# Altium schematic sheet LPDDR4.SchDoc
size 420 x 297 mm; SheetNumber: 5; SheetTotal: 16
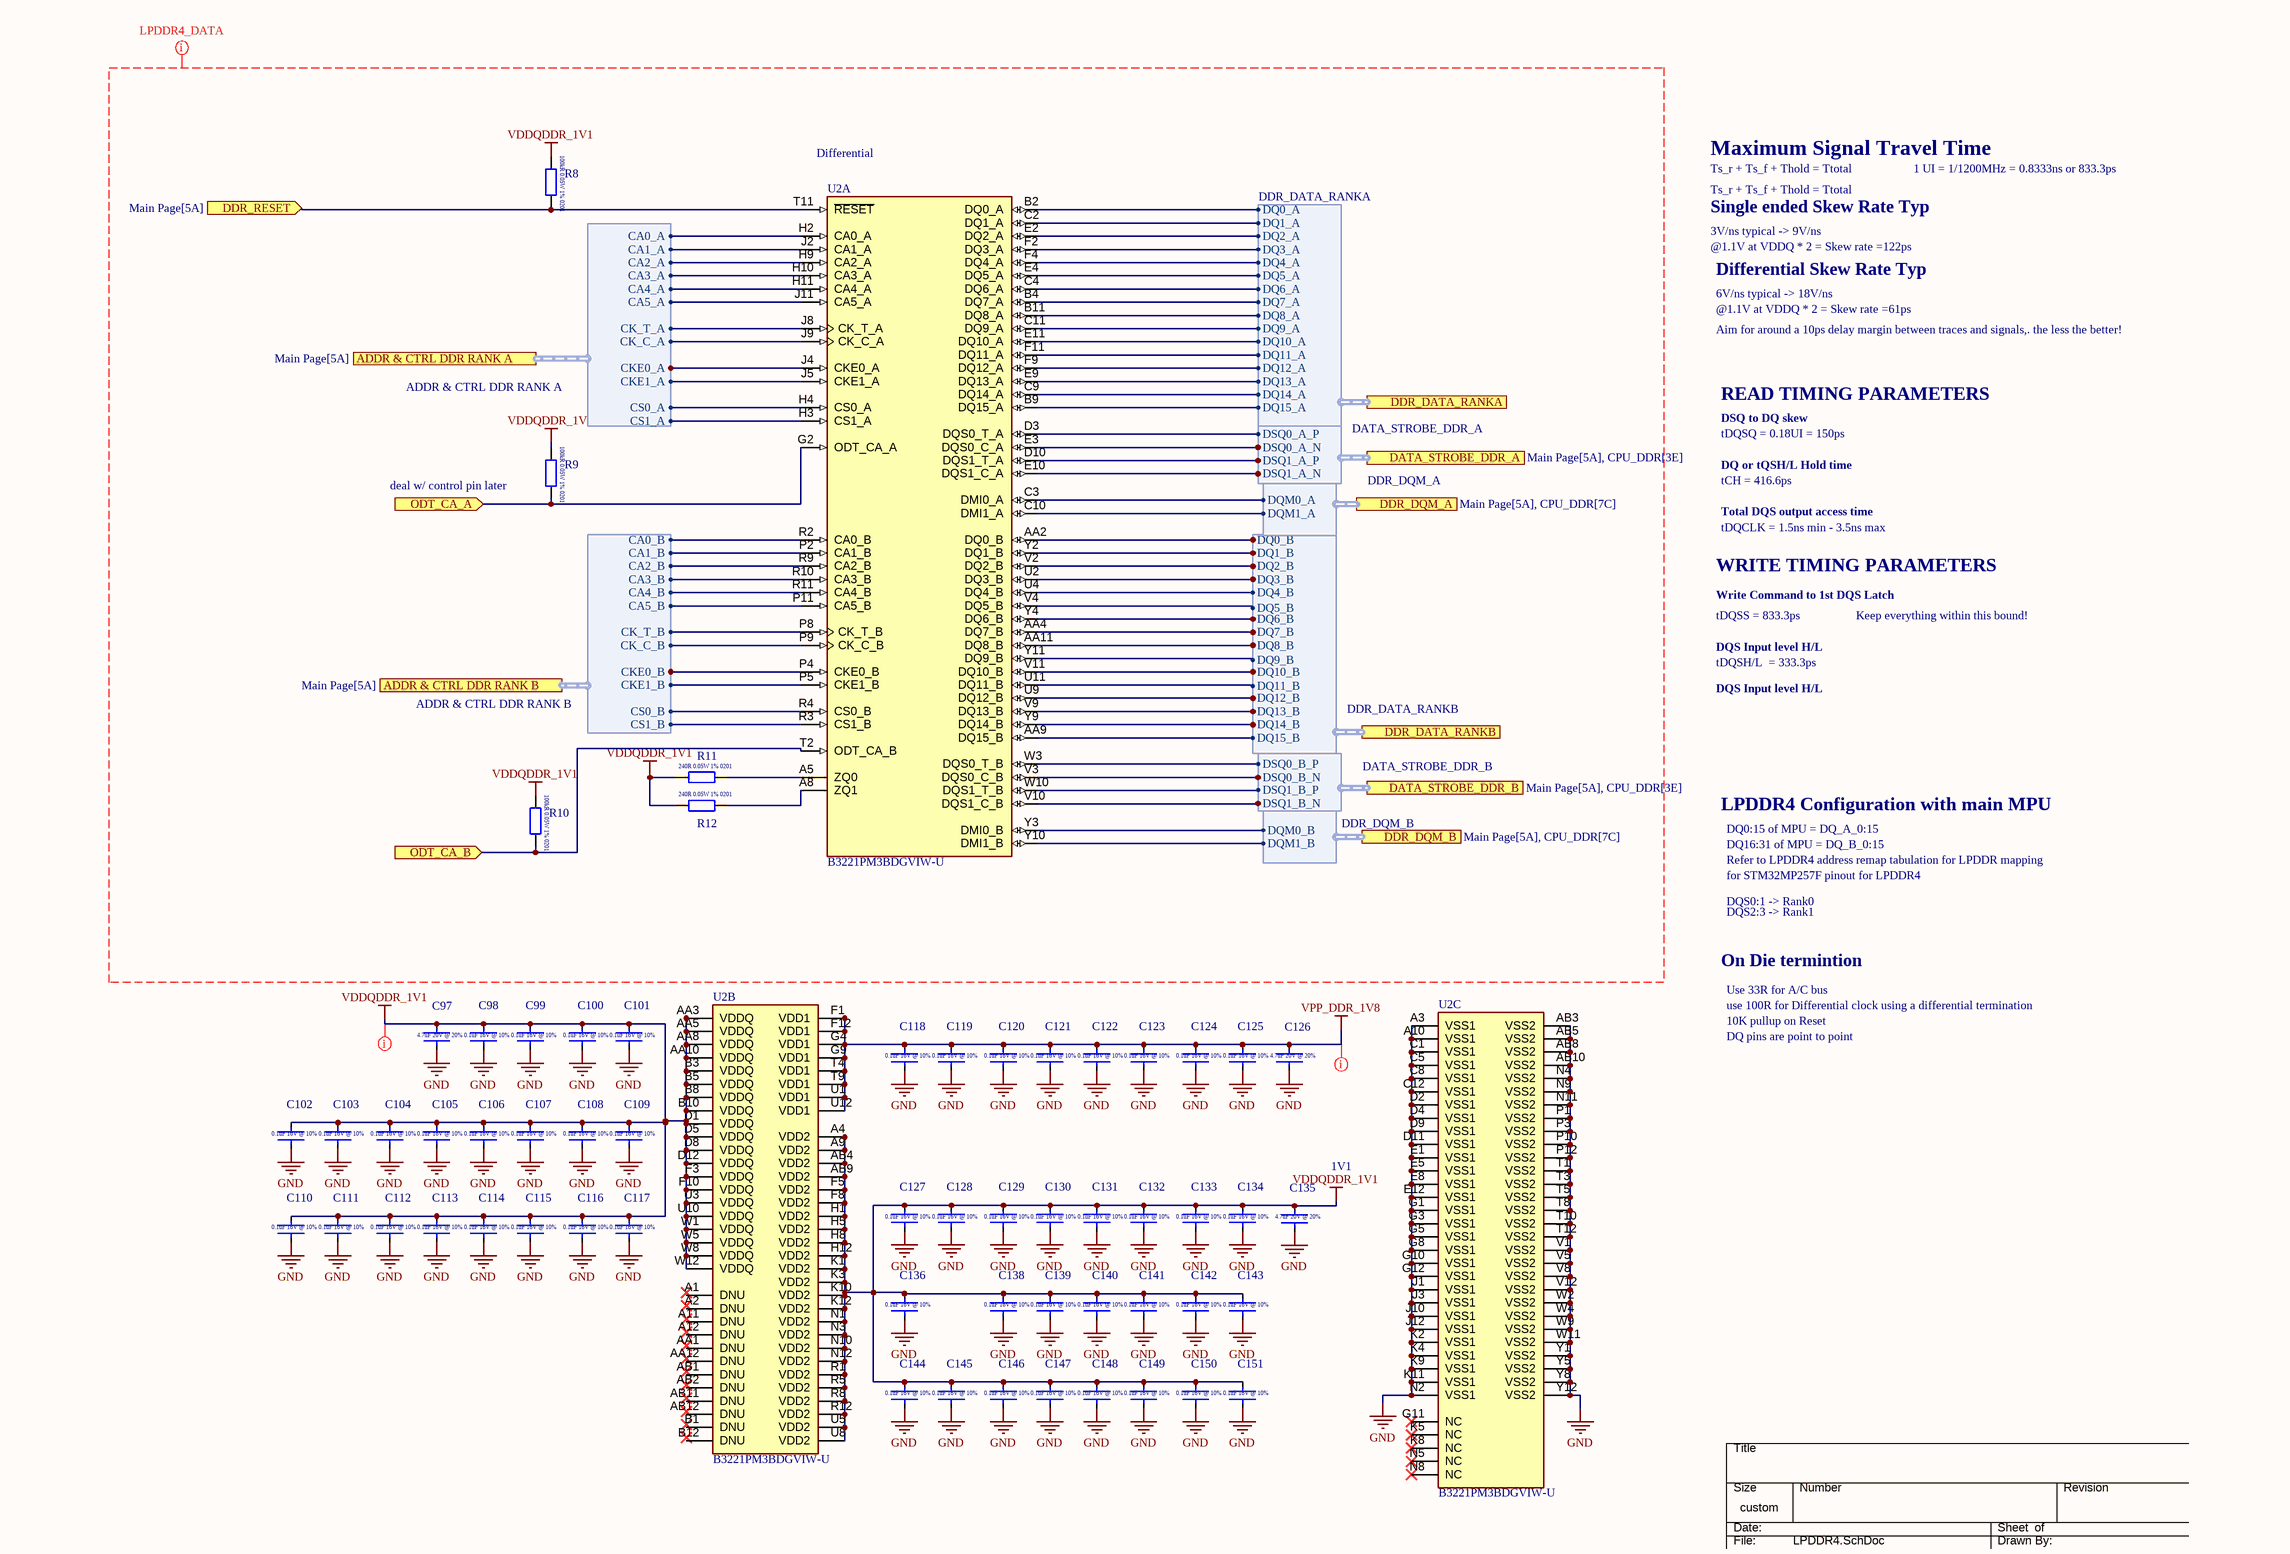
[diagram p0: LPDDR4.SchDoc]

## Parts
C97  4.7uF  [CAPC1005X06L]  (value not drawn)
C98  0.1uF  [CAPC0603X03L]  (value not drawn)
C99  0.1uF  [CAPC0603X03L]  (value not drawn)
C100  0.1uF  [CAPC0603X03L]  (value not drawn)
C101  0.1uF  [CAPC0603X03L]  (value not drawn)
C102  0.1uF  [CAPC0603X03L]  (value not drawn)
C103  0.1uF  [CAPC0603X03L]  (value not drawn)
C104  0.1uF  [CAPC0603X03L]  (value not drawn)
C105  0.1uF  [CAPC0603X03L]  (value not drawn)
C106  0.1uF  [CAPC0603X03L]  (value not drawn)
C107  0.1uF  [CAPC0603X03L]  (value not drawn)
C108  0.1uF  [CAPC0603X03L]  (value not drawn)
C109  0.1uF  [CAPC0603X03L]  (value not drawn)
C110  0.1uF  [CAPC0603X03L]  (value not drawn)
C111  0.1uF  [CAPC0603X03L]  (value not drawn)
C112  0.1uF  [CAPC0603X03L]  (value not drawn)
C113  0.1uF  [CAPC0603X03L]  (value not drawn)
C114  0.1uF  [CAPC0603X03L]  (value not drawn)
C115  0.1uF  [CAPC0603X03L]  (value not drawn)
C116  0.1uF  [CAPC0603X03L]  (value not drawn)
C117  0.1uF  [CAPC0603X03L]  (value not drawn)
C118  0.1uF  [CAPC0603X03L]  (value not drawn)
C119  0.1uF  [CAPC0603X03L]  (value not drawn)
C120  0.1uF  [CAPC0603X03L]  (value not drawn)
C121  0.1uF  [CAPC0603X03L]  (value not drawn)
C122  0.1uF  [CAPC0603X03L]  (value not drawn)
C123  0.1uF  [CAPC0603X03L]  (value not drawn)
C124  0.1uF  [CAPC0603X03L]  (value not drawn)
C125  0.1uF  [CAPC0603X03L]  (value not drawn)
C126  4.7uF  [CAPC1005X06L]  (value not drawn)
C127  0.1uF  [CAPC0603X03L]  (value not drawn)
C128  0.1uF  [CAPC0603X03L]  (value not drawn)
C129  0.1uF  [CAPC0603X03L]  (value not drawn)
C130  0.1uF  [CAPC0603X03L]  (value not drawn)
C131  0.1uF  [CAPC0603X03L]  (value not drawn)
C132  0.1uF  [CAPC0603X03L]  (value not drawn)
C133  0.1uF  [CAPC0603X03L]  (value not drawn)
C134  0.1uF  [CAPC0603X03L]  (value not drawn)
C135  4.7uF  [CAPC1005X06L]  (value not drawn)
C136  0.1uF  [CAPC0603X03L]  (value not drawn)
C138  0.1uF  [CAPC0603X03L]  (value not drawn)
C139  0.1uF  [CAPC0603X03L]  (value not drawn)
C140  0.1uF  [CAPC0603X03L]  (value not drawn)
C141  0.1uF  [CAPC0603X03L]  (value not drawn)
C142  0.1uF  [CAPC0603X03L]  (value not drawn)
C143  0.1uF  [CAPC0603X03L]  (value not drawn)
C144  0.1uF  [CAPC0603X03L]  (value not drawn)
C145  0.1uF  [CAPC0603X03L]  (value not drawn)
C146  0.1uF  [CAPC0603X03L]  (value not drawn)
C147  0.1uF  [CAPC0603X03L]  (value not drawn)
C148  0.1uF  [CAPC0603X03L]  (value not drawn)
C149  0.1uF  [CAPC0603X03L]  (value not drawn)
C150  0.1uF  [CAPC0603X03L]  (value not drawn)
C151  0.1uF  [CAPC0603X03L]  (value not drawn)
R8  ERJ-1GNF1003C  [RESC0603X03L]  (value not drawn)
R9  ERJ-1GNF1003C  [RESC0603X03L]  (value not drawn)
R10  ERJ-1GNF1003C  [RESC0603X03L]  (value not drawn)
R11  ERJ-1GNF2400C  [RESC0603X03L]  (value not drawn)
R12  ERJ-1GNF2400C  [RESC0603X03L]  (value not drawn)
U2  B3221PM3BDGVIW-U  [Q6422PM3BDGVK-U]  (parts A,B,C of 3)

## Ports
ADDR & CTRL DDR RANK A (harness ADDR & CTRL DDR RANK A, see Main Page[5A]), ADDR & CTRL DDR RANK B (harness ADDR & CTRL DDR RANK B, see Main Page[5A]), DATA_STROBE_DDR_A (harness DATA_STROBE_DDR_A, see Main Page[5A], CPU_DDR[3E]), DATA_STROBE_DDR_B (harness DATA_STROBE_DDR_B, see Main Page[5A], CPU_DDR[3E]), DDR_DATA_RANKA (harness DDR_DATA_RANKA, see Main Page[5A], CPU_DDR[3D]), DDR_DATA_RANKB (harness DDR_DATA_RANKB, see Main Page[5A], CPU_DDR[3E]), DDR_DQM_A (harness DDR_DQM_A, see Main Page[5A], CPU_DDR[7C]), DDR_DQM_B (harness DDR_DQM_B, see Main Page[5A], CPU_DDR[7C]), DDR_RESET (in, see Main Page[5A]), ODT_CA_A (in), ODT_CA_B (in)

## Harnesses
DDR_DATA_RANKB: DQ0_B, DQ10_B, DQ11_B, DQ12_B, DQ13_B, DQ14_B, DQ15_B, DQ1_B, DQ2_B, DQ3_B, DQ4_B, DQ5_B, DQ6_B, DQ7_B, DQ8_B, DQ9_B
DDR_DATA_RANKA: DQ0_A, DQ10_A, DQ11_A, DQ12_A, DQ13_A, DQ14_A, DQ15_A, DQ1_A, DQ2_A, DQ3_A, DQ4_A, DQ5_A, DQ6_A, DQ7_A, DQ8_A, DQ9_A
ADDR & CTRL DDR RANK A: CA0_A, CA1_A, CA2_A, CA3_A, CA4_A, CA5_A, CKE0_A, CKE1_A, CK_C_A, CK_T_A, CS0_A, CS1_A
ADDR & CTRL DDR RANK B: CA0_B, CA1_B, CA2_B, CA3_B, CA4_B, CA5_B, CKE0_B, CKE1_B, CK_C_B, CK_T_B, CS0_B, CS1_B
DATA_STROBE_DDR_A: DSQ0_A_N, DSQ0_A_P, DSQ1_A_N, DSQ1_A_P
DATA_STROBE_DDR_B: DSQ0_B_N, DSQ0_B_P, DSQ1_B_N, DSQ1_B_P
DDR_DQM_A: DQM0_A, DQM1_A
DDR_DQM_B: DQM0_B, DQM1_B

## Nets
GND: C97.1 C98.1 C99.1 C100.1 C101.1 C102.1 C103.1 C104.1 C105.1 C106.1 C107.1 C108.1 C109.1 C110.1 C111.1 C112.1 C113.1 C114.1 C115.1 C116.1 C117.1 C118.1 C119.1 C120.1 C121.1 C122.1 C123.1 C124.1 C125.1 C126.1 C127.1 C128.1 C129.1 C130.1 C131.1 C132.1 C133.1 C134.1 C135.1 C136.1 C138.1 C139.1 C140.1 C141.1 C142.1 C143.1 C144.1 C145.1 C146.1 C147.1 C148.1 C149.1 C150.1 C151.1 U2.A3(VSS1) U2.A10(VSS1) U2.AB3(VSS2) U2.AB5(VSS2) U2.AB8(VSS2) U2.AB10(VSS2) U2.C1(VSS1) U2.C5(VSS1) U2.C8(VSS1) U2.C12(VSS1) U2.D2(VSS1) U2.D4(VSS1) U2.D9(VSS1) U2.D11(VSS1) U2.E1(VSS1) U2.E5(VSS1) U2.E8(VSS1) U2.E12(VSS1) U2.G1(VSS1) U2.G3(VSS1) U2.G5(VSS1) U2.G8(VSS1) U2.G10(VSS1) U2.G12(VSS1) U2.J1(VSS1) U2.J3(VSS1) U2.J10(VSS1) U2.J12(VSS1) U2.K2(VSS1) U2.K4(VSS1) U2.K9(VSS1) U2.K11(VSS1) U2.N2(VSS1) U2.N4(VSS2) U2.N9(VSS2) U2.N11(VSS2) U2.P1(VSS2) U2.P3(VSS2) U2.P10(VSS2) U2.P12(VSS2) U2.T1(VSS2) U2.T3(VSS2) U2.T5(VSS2) U2.T8(VSS2) U2.T10(VSS2) U2.T12(VSS2) U2.V1(VSS2) U2.V5(VSS2) U2.V8(VSS2) U2.V12(VSS2) U2.W2(VSS2) U2.W4(VSS2) U2.W9(VSS2) U2.W11(VSS2) U2.Y1(VSS2) U2.Y5(VSS2) U2.Y8(VSS2) U2.Y12(VSS2)
VDDQDDR_1V1: C97.2 C98.2 C99.2 C100.2 C101.2 C102.2 C103.2 C104.2 C105.2 C106.2 C107.2 C108.2 C109.2 C110.2 C111.2 C112.2 C113.2 C114.2 C115.2 C116.2 C117.2 C127.2 C128.2 C129.2 C130.2 C131.2 C132.2 C133.2 C134.2 C135.2 C136.2 C138.2 C139.2 C140.2 C141.2 C142.2 C143.2 C144.2 C145.2 C146.2 C147.2 C148.2 C149.2 C150.2 C151.2 R8.1 R9.1 R10.1 R11.1 R12.1 U2.A4(VDD2) U2.A9(VDD2) U2.AA3(VDDQ) U2.AA5(VDDQ) U2.AA8(VDDQ) U2.AA10(VDDQ) U2.AB4(VDD2) U2.AB9(VDD2) U2.B3(VDDQ) U2.B5(VDDQ) U2.B8(VDDQ) U2.B10(VDDQ) U2.D1(VDDQ) U2.D5(VDDQ) U2.D8(VDDQ) U2.D12(VDDQ) U2.F3(VDDQ) U2.F5(VDD2) U2.F8(VDD2) U2.F10(VDDQ) U2.H1(VDD2) U2.H5(VDD2) U2.H8(VDD2) U2.H12(VDD2) U2.K1(VDD2) U2.K3(VDD2) U2.K10(VDD2) U2.K12(VDD2) U2.N1(VDD2) U2.N3(VDD2) U2.N10(VDD2) U2.N12(VDD2) U2.R1(VDD2) U2.R5(VDD2) U2.R8(VDD2) U2.R12(VDD2) U2.U3(VDDQ) U2.U5(VDD2) U2.U8(VDD2) U2.U10(VDDQ) U2.W1(VDDQ) U2.W5(VDDQ) U2.W8(VDDQ) U2.W12(VDDQ)
VPP_DDR_1V8: C118.2 C119.2 C120.2 C121.2 C122.2 C123.2 C124.2 C125.2 C126.2 U2.F1(VDD1) U2.F12(VDD1) U2.G4(VDD1) U2.G9(VDD1) U2.T4(VDD1) U2.T9(VDD1) U2.U1(VDD1) U2.U12(VDD1)
DDR_RESET: R8.2 U2.T11(~{RESET}) ; port DDR_RESET
ODT_CA_A: R9.2 U2.G2(ODT_CA_A) ; port ODT_CA_A
ODT_CA_B: R10.2 U2.T2(ODT_CA_B) ; port ODT_CA_B
NetR11_2: R11.2 U2.A5(ZQ0)
NetR12_2: R12.2 U2.A8(ZQ1)
NetU2_AA2: U2.AA2(DQ0_B) ; port DDR_DATA_RANKB.DQ0_B
NetU2_AA4: U2.AA4(DQ7_B) ; port DDR_DATA_RANKB.DQ7_B
NetU2_AA9: U2.AA9(DQ15_B) ; port DDR_DATA_RANKB.DQ15_B
NetU2_AA11: U2.AA11(DQ8_B) ; port DDR_DATA_RANKB.DQ8_B
NetU2_B2: U2.B2(DQ0_A) ; port DDR_DATA_RANKA.DQ0_A
NetU2_B4: U2.B4(DQ7_A) ; port DDR_DATA_RANKA.DQ7_A
NetU2_B9: U2.B9(DQ15_A) ; port DDR_DATA_RANKA.DQ15_A
NetU2_B11: U2.B11(DQ8_A) ; port DDR_DATA_RANKA.DQ8_A
NetU2_C2: U2.C2(DQ1_A) ; port DDR_DATA_RANKA.DQ1_A
NetU2_C3: U2.C3(DMI0_A) ; port DDR_DQM_A.DQM0_A
NetU2_C4: U2.C4(DQ6_A) ; port DDR_DATA_RANKA.DQ6_A
NetU2_C9: U2.C9(DQ14_A) ; port DDR_DATA_RANKA.DQ14_A
NetU2_C10: U2.C10(DMI1_A) ; port DDR_DQM_A.DQM1_A
NetU2_C11: U2.C11(DQ9_A) ; port DDR_DATA_RANKA.DQ9_A
NetU2_D3: U2.D3(DQS0_T_A) ; port DATA_STROBE_DDR_A.DSQ0_A_P
NetU2_D10: U2.D10(DQS1_T_A) ; port DATA_STROBE_DDR_A.DSQ1_A_P
NetU2_E2: U2.E2(DQ2_A) ; port DDR_DATA_RANKA.DQ2_A
NetU2_E3: U2.E3(DQS0_C_A) ; port DATA_STROBE_DDR_A.DSQ0_A_N
NetU2_E4: U2.E4(DQ5_A) ; port DDR_DATA_RANKA.DQ5_A
NetU2_E9: U2.E9(DQ13_A) ; port DDR_DATA_RANKA.DQ13_A
NetU2_E10: U2.E10(DQS1_C_A) ; port DATA_STROBE_DDR_A.DSQ1_A_N
NetU2_E11: U2.E11(DQ10_A) ; port DDR_DATA_RANKA.DQ10_A
NetU2_F2: U2.F2(DQ3_A) ; port DDR_DATA_RANKA.DQ3_A
NetU2_F4: U2.F4(DQ4_A) ; port DDR_DATA_RANKA.DQ4_A
NetU2_F9: U2.F9(DQ12_A) ; port DDR_DATA_RANKA.DQ12_A
NetU2_F11: U2.F11(DQ11_A) ; port DDR_DATA_RANKA.DQ11_A
NetU2_H2: U2.H2(CA0_A) ; port ADDR & CTRL DDR RANK A.CA0_A
NetU2_H3: U2.H3(CS1_A) ; port ADDR & CTRL DDR RANK A.CS1_A
NetU2_H4: U2.H4(CS0_A) ; port ADDR & CTRL DDR RANK A.CS0_A
NetU2_H9: U2.H9(CA2_A) ; port ADDR & CTRL DDR RANK A.CA2_A
NetU2_H10: U2.H10(CA3_A) ; port ADDR & CTRL DDR RANK A.CA3_A
NetU2_H11: U2.H11(CA4_A) ; port ADDR & CTRL DDR RANK A.CA4_A
NetU2_J2: U2.J2(CA1_A) ; port ADDR & CTRL DDR RANK A.CA1_A
NetU2_J4: U2.J4(CKE0_A) ; port ADDR & CTRL DDR RANK A.CKE0_A
NetU2_J5: U2.J5(CKE1_A) ; port ADDR & CTRL DDR RANK A.CKE1_A
NetU2_J8: U2.J8(CK_T_A) ; port ADDR & CTRL DDR RANK A.CK_T_A
NetU2_J9: U2.J9(CK_C_A) ; port ADDR & CTRL DDR RANK A.CK_C_A
NetU2_J11: U2.J11(CA5_A) ; port ADDR & CTRL DDR RANK A.CA5_A
NetU2_P2: U2.P2(CA1_B) ; port ADDR & CTRL DDR RANK B.CA1_B
NetU2_P4: U2.P4(CKE0_B) ; port ADDR & CTRL DDR RANK B.CKE0_B
NetU2_P5: U2.P5(CKE1_B) ; port ADDR & CTRL DDR RANK B.CKE1_B
NetU2_P8: U2.P8(CK_T_B) ; port ADDR & CTRL DDR RANK B.CK_T_B
NetU2_P9: U2.P9(CK_C_B) ; port ADDR & CTRL DDR RANK B.CK_C_B
NetU2_P11: U2.P11(CA5_B) ; port ADDR & CTRL DDR RANK B.CA5_B
NetU2_R2: U2.R2(CA0_B) ; port ADDR & CTRL DDR RANK B.CA0_B
NetU2_R3: U2.R3(CS1_B) ; port ADDR & CTRL DDR RANK B.CS1_B
NetU2_R4: U2.R4(CS0_B) ; port ADDR & CTRL DDR RANK B.CS0_B
NetU2_R9: U2.R9(CA2_B) ; port ADDR & CTRL DDR RANK B.CA2_B
NetU2_R10: U2.R10(CA3_B) ; port ADDR & CTRL DDR RANK B.CA3_B
NetU2_R11: U2.R11(CA4_B) ; port ADDR & CTRL DDR RANK B.CA4_B
NetU2_U2: U2.U2(DQ3_B) ; port DDR_DATA_RANKB.DQ3_B
NetU2_U4: U2.U4(DQ4_B) ; port DDR_DATA_RANKB.DQ4_B
NetU2_U9: U2.U9(DQ12_B) ; port DDR_DATA_RANKB.DQ12_B
NetU2_U11: U2.U11(DQ11_B) ; port DDR_DATA_RANKB.DQ11_B
NetU2_V2: U2.V2(DQ2_B) ; port DDR_DATA_RANKB.DQ2_B
NetU2_V3: U2.V3(DQS0_C_B) ; port DATA_STROBE_DDR_B.DSQ0_B_N
NetU2_V4: U2.V4(DQ5_B) ; port DDR_DATA_RANKB.DQ5_B
NetU2_V9: U2.V9(DQ13_B) ; port DDR_DATA_RANKB.DQ13_B
NetU2_V10: U2.V10(DQS1_C_B) ; port DATA_STROBE_DDR_B.DSQ1_B_N
NetU2_V11: U2.V11(DQ10_B) ; port DDR_DATA_RANKB.DQ10_B
NetU2_W3: U2.W3(DQS0_T_B) ; port DATA_STROBE_DDR_B.DSQ0_B_P
NetU2_W10: U2.W10(DQS1_T_B) ; port DATA_STROBE_DDR_B.DSQ1_B_P
NetU2_Y2: U2.Y2(DQ1_B) ; port DDR_DATA_RANKB.DQ1_B
NetU2_Y3: U2.Y3(DMI0_B) ; port DDR_DQM_B.DQM0_B
NetU2_Y4: U2.Y4(DQ6_B) ; port DDR_DATA_RANKB.DQ6_B
NetU2_Y9: U2.Y9(DQ14_B) ; port DDR_DATA_RANKB.DQ14_B
NetU2_Y10: U2.Y10(DMI1_B) ; port DDR_DQM_B.DQM1_B
NetU2_Y11: U2.Y11(DQ9_B) ; port DDR_DATA_RANKB.DQ9_B

Not connected (* = marked no-connect by the designer): U2 A1(DNU) A2(DNU) A11(DNU) A12(DNU) AA1(DNU) AA12(DNU) AB1(DNU) AB2(DNU) AB11(DNU) AB12(DNU) B1(DNU) B12(DNU) G11(NC)* K5(NC)* K8(NC)* N5(NC)* N8(NC)*

## Layout directives
net class LPDDR4_DATA: VDDQDDR_1V1
net class LPDDR4_PWR: VDDQDDR_1V1, VPP_DDR_1V8

## Notes on the sheet
- (near U2) Differential
- Maximum Signal Travel Time
- Ts_r + Ts_f + Thold = Ttotal
- 1 UI = 1/1200MHz = 0.8333ns or 833.3ps
- Single ended Skew Rate Typ
- 3V/ns typical -> 9V/ns
- @1.1V at VDDQ * 2 = Skew rate =122ps
- Differential Skew Rate Typ
- 6V/ns typical -> 18V/ns
- @1.1V at VDDQ * 2 = Skew rate =61ps
- Aim for around a 10ps delay margin between traces and signals,. the less the better!
- tDQSQ = 0.18UI = 150ps
- DSQ to DQ skew
- READ TIMING PARAMETERS
- (near R9) deal w/ control pin later
- DQ or tQSH/L Hold time
- tCH = 416.6ps
- Total DQS output access time
- WRITE TIMING PARAMETERS
- tDQCLK = 1.5ns min - 3.5ns max
- Write Command to 1st DQS Latch
- tDQSS = 833.3ps
- DQS Input level H/L
- Keep everything within this bound!
- tDQSH/L  = 333.3ps
- LPDDR4 Configuration with main MPU
- DQ0:15 of MPU = DQ_A_0:15
- DQ16:31 of MPU = DQ_B_0:15
- Refer to LPDDR4 address remap tabulation for LPDDR mapping
- for STM32MP257F pinout for LPDDR4
- DQS0:1 -> Rank0
- DQS2:3 -> Rank1
- On Die termintion
- Use 33R for A/C bus
- use 100R for Differential clock using a differential termination
- 10K pullup on Reset
- DQ pins are point to point
- 1V1
- THIS DOCUMENT AND THE DATA DISCLOSED HEREIN OR
- HEREWITH IS THE PROPERTY OF ALTIUM LIMITED AND MAY
- DWG NO:
- REVISION
- REV:
- DESCRIPTION
- DATE
- APPROVED
- BE FREELY DISTRIBUTED IN WHOLE. NO RIGHTS ARE
- RESERVED OR EXPRESS OR IMPLIED WARANTEE GIVEN.
- ENG:
- APPROVALS
- PROJECT
- DSN:
- CHK:
- REFERENCE DOCUMENTS
- PROJECT REVISION:
- TITLE
- DOCUMENT REVISION:
- DESIGN ITEM:
- BOM:
- FAB DWG:
- PCB DWG:
- ASSY DWG:
- SCALE:
- A3
- SIZE
- CAGE CODE
- FILE NAME
- DWG NO.
- SHEET
- OF
- REV
- (in symbol CL05A475MO5NUNC) 4.7uF 20V @ 20%
- (in symbol ERJ-1GNF1003C) 100kR 0.05W 1% 0201
- (in symbol ERJ-1GNF2400C) 240R 0.05W 1% 0201
- (in symbol GRM033R61E104KE14J) 0.1uF 16V @ 10%

## Library data of the parts
C97 C126 C135 = CL05A475MO5NUNC: 4.7 µF ±20% 16V Ceramic Capacitor X5R 0402 (1005 Metric)
C98-C125 C127-C134 C136 C138-C151 = GRM033R61E104KE14J: 0.1 µF ±10% 25V Ceramic Capacitor X5R 0201 (0603 Metric)0.1 µF ±10% 25V Ceramic Capacitor X5R 0201 (0603 Metric)
R8-R10 = ERJ-1GNF1003C: 100 kOhms ±1% 0.05W, 1/20W Chip Resistor 0201 (0603 Metric) Thick Film; ComponentLink1Description: New link; ComponentLink1URL: https://www.digikey.com.au/en/products/detail/panasonic-electronic-components/ERJ-1GNF1003C/2036340
U2 = Q6422PM3BDGVK-U: SDRAM - Mobile LPDDR4 Memory IC 64Gbit 2.133 GHz 3.5 ns 200-FBGA (10x14.5); Package: None; Price: None; Value: *; MP: Q6422PM3BDGVK-U; Availability: Unavailable; ComponentLink1Description: New link; ComponentLink1URL: https://www.digikey.com.au/en/products/detail/kingston-technology/Q6422PM3BDGVK-U/25321958?gad_source=1&gbraid=0AAAAADrbLlj2-DufyOLmPBQqugpZCYbaj&gclid=Cj0KCQjwzrzABhD8ARIsANlSWNPtBMk-xmUbnWeTZrE8FXO4iVJvRiPTf1MXYD-jc0_9yWwB78P3EFEaAgkvEALw_wcB&gclsrc=aw.ds
R11 R12 = ERJ-1GNF2400C: ComponentLink1Description: New link; ComponentLink1URL: https://www.digikey.com.au/en/products/detail/panasonic-electronic-components/ERJ-1GNF2400C/2036039